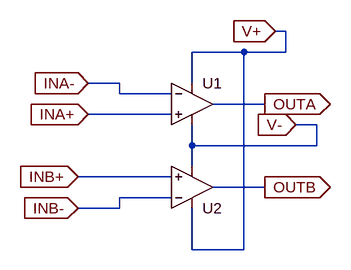
[diagram p0: schematic Draft30.asc]
Draft30.asc, the LTspice schematic file:
Version 4.1
SHEET 1 880 680
WIRE 256 48 240 48
WIRE 192 80 112 80
WIRE 256 80 256 48
WIRE 256 80 192 80
WIRE 0 128 -48 128
WIRE 112 128 112 80
WIRE 0 144 0 128
WIRE 80 144 0 144
WIRE 224 160 144 160
WIRE 80 176 -48 176
WIRE 304 192 272 192
WIRE 112 224 112 192
WIRE 304 224 304 192
WIRE 304 224 112 224
WIRE 112 256 112 224
WIRE 80 272 -64 272
WIRE 224 288 144 288
WIRE 80 304 0 304
WIRE 0 320 0 304
WIRE 0 320 -64 320
WIRE 112 384 112 320
WIRE 192 384 192 80
WIRE 192 384 112 384
FLAG 240 48 V+
IOPIN 240 48 In
FLAG 272 192 V-
IOPIN 272 192 In
FLAG 224 160 OUTA
IOPIN 224 160 Out
FLAG 224 288 OUTB
IOPIN 224 288 Out
FLAG -48 176 INA+
IOPIN -48 176 In
FLAG -48 128 INA-
IOPIN -48 128 In
FLAG -64 272 INB+
IOPIN -64 272 In
FLAG -64 320 INB-
IOPIN -64 320 In
SYMBOL OpAmps\\opamp2 112 96 R0
SYMATTR InstName U1
SYMATTR Value ""
SYMBOL OpAmps\\opamp2 112 352 M180
SYMATTR InstName U2
SYMATTR Value ""

The netlist it stands for:
* Draft30.asc
X§U1 INA+ INA- V+ V- OUTA opamp2  ; pins In+ In- V+ V- OUT
X§U2 INB+ INB- V+ V- OUTB opamp2  ; pins In+ In- V+ V- OUT
.backanno
.end